# EAGLE design eagleSchem (EAGLE 9.6.2)
CNAME: Microcontroller + Power + Headers; CREVISION: V1.0.0; DESIGNER: Cole Matthews
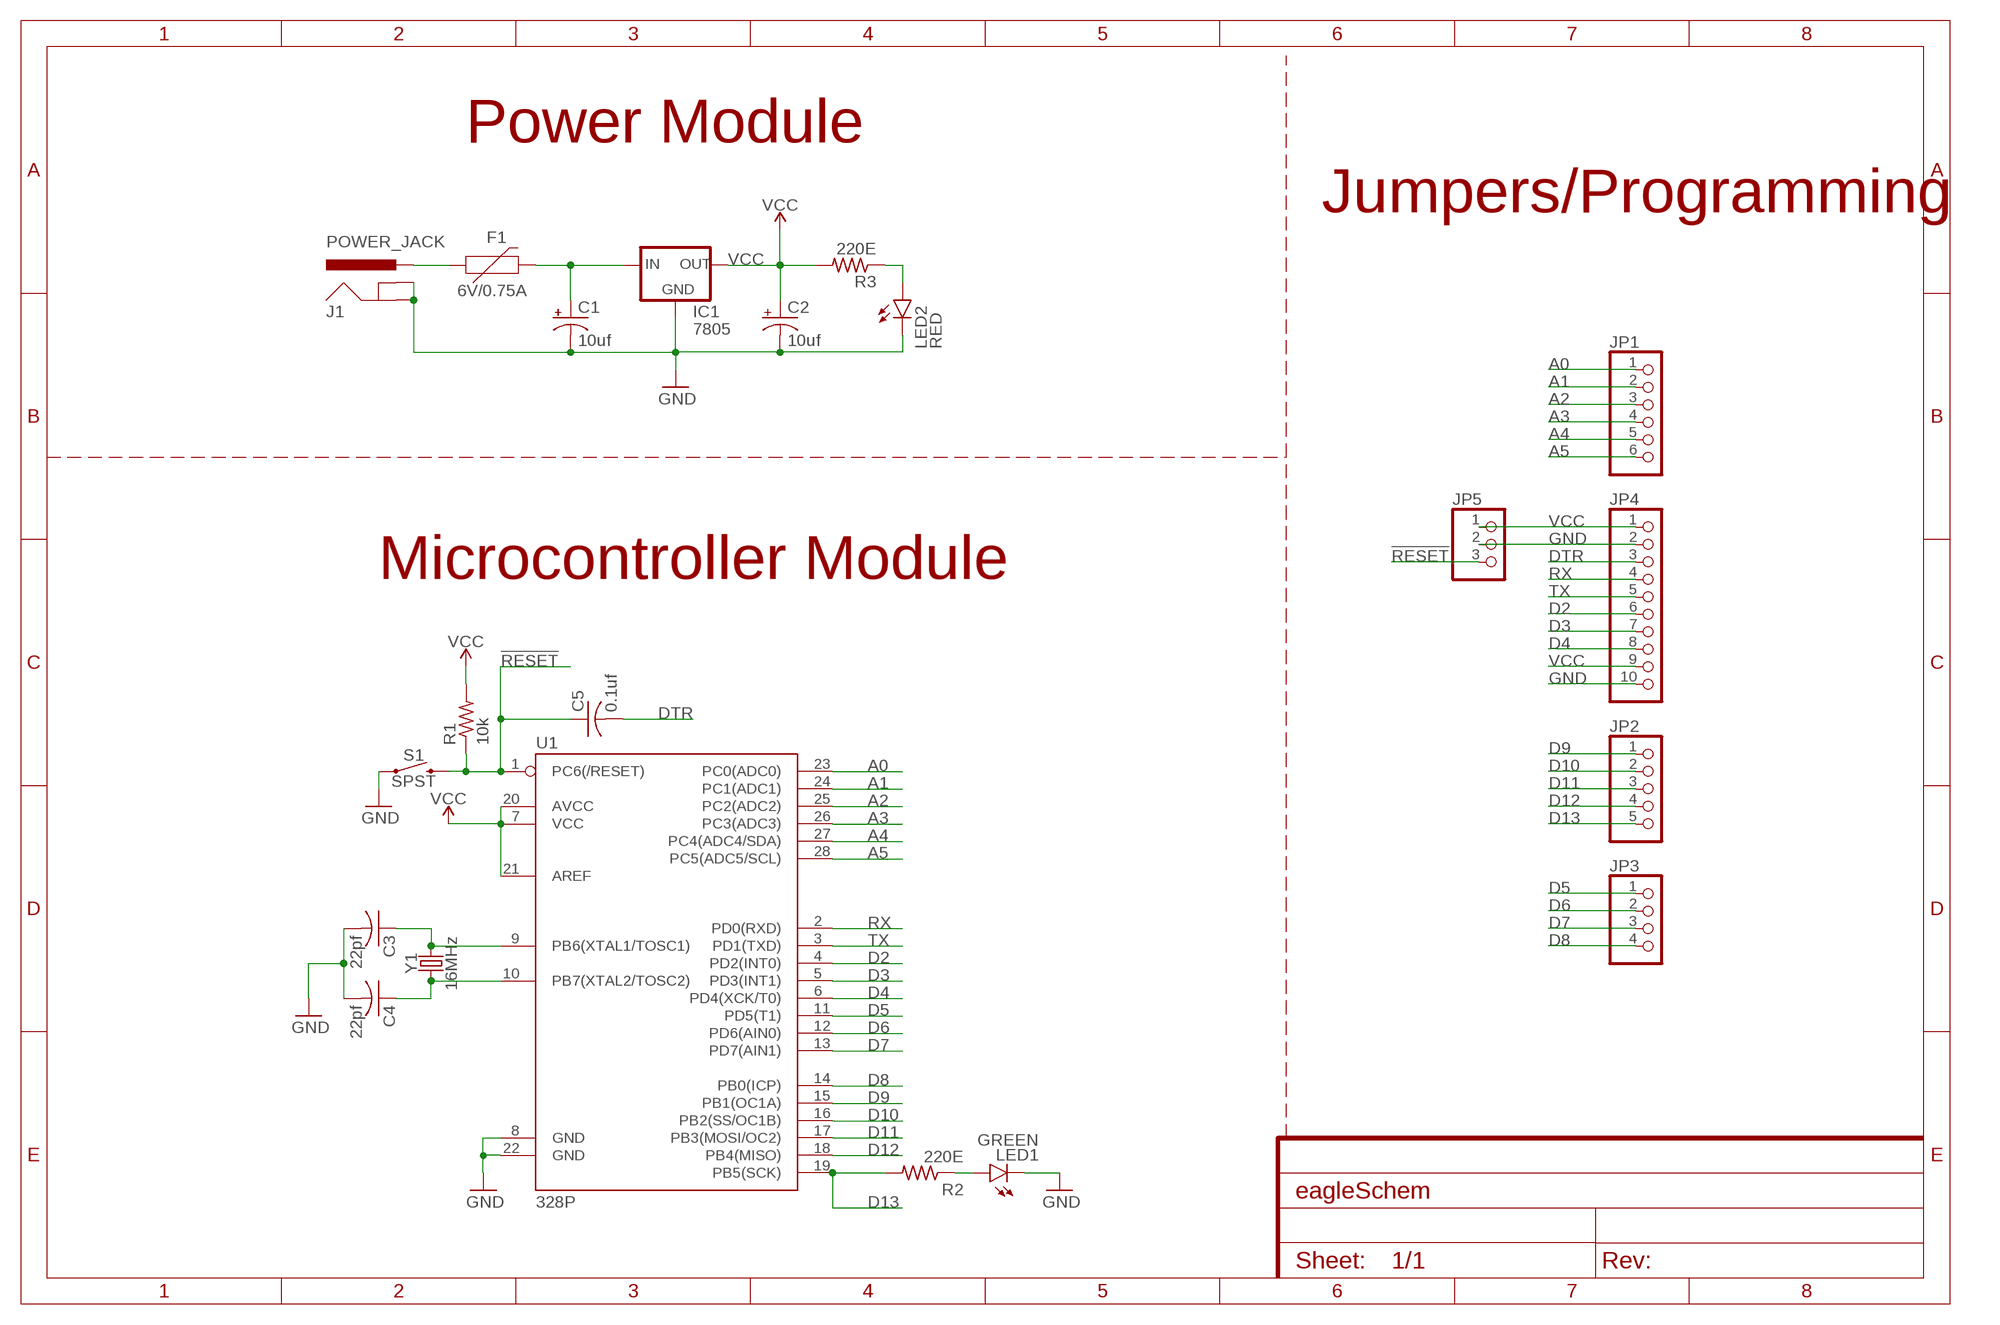
[diagram p0: schematic, sheet 1]

## Parts
C1  10uf  CPOL-USE2.5-6  [E2,5-6]
C2  10uf  CPOL-USE2.5-6  [E2,5-6]
C3  22pf  C-US025-024X044  [C025-024X044]
C4  22pf  C-US025-024X044  [C025-024X044]
C5  0.1uf  C-US025-024X044  [C025-024X044]
F1  6V/0.75A  PPTC_0.75A  [1206]
IC1  7805  78XXS  [78XXS]
J1  POWER_JACK  [POWER_JACK_PTH]
JP1  PINHD-1X6  [1X06]
JP2  PINHD-1X5  [1X05]
JP3  PINHD-1X4  [1X04]
JP4  PINHD-1X10  [1X10]
JP5  PINHD-1X3  [1X03]
LED1  GREEN  LED3MM  [LED3MM]
LED2  RED  LED3MM  [LED3MM]
R1  10k  R-US_0204/7  [0204/7]
R2  220E  R-US_0204/7  [0204/7]
R3  220E  R-US_0204/7  [0204/7]
S1  SPST  MOMENTARY-SWITCH-SPST-PTH-6.0MM  [TACTILE_SWITCH_PTH_6.0MM]
U1  328P  ATMEGA328P_PDIP  [DIP28]
Y1  16MHz  CRYSTAL-16MHZPTH-HC49US  [HC49US]

## Nets
!RESET: C5.1 JP5.3 R1.1 S1.3 U1.1(PC6(/RESET))
A0: JP1.1 U1.23(PC0(ADC0))
A1: JP1.2 U1.24(PC1(ADC1))
A2: JP1.3 U1.25(PC2(ADC2))
A3: JP1.4 U1.26(PC3(ADC3))
A4: JP1.5 U1.27(PC4(ADC4/SDA))
A5: JP1.6 U1.28(PC5(ADC5/SCL))
D2: JP4.6 U1.4(PD2(INT0))
D3: JP4.7 U1.5(PD3(INT1))
D4: JP4.8 U1.6(PD4(XCK/T0))
D5: JP3.1 U1.11(PD5(T1))
D6: JP3.2 U1.12(PD6(AIN0))
D7: JP3.3 U1.13(PD7(AIN1))
D8: JP3.4 U1.14(PB0(ICP))
D9: JP2.1 U1.15(PB1(OC1A))
D10: JP2.2 U1.16(PB2(SS/OC1B))
D11: JP2.3 U1.17(PB3(MOSI/OC2))
D12: JP2.4 U1.18(PB4(MISO))
D13: JP2.5 R2.2 U1.19(PB5(SCK))
DTR: C5.2 JP4.3
GND: C1.- C2.- C3.2 C4.2 IC1.GND J1.GND J1.GNDBREAK JP4.2 JP4.10 JP5.2 LED1.K(C) LED2.K(C) S1.1 U1.8(GND) U1.22(GND)
N$1: C1.+ F1.2 IC1.IN
N$2: C3.1 U1.9(PB6(XTAL1/TOSC1)) Y1.2
N$3: C4.1 U1.10(PB7(XTAL2/TOSC2)) Y1.1
N$5: LED2.A R3.1
N$6: LED1.A R2.1
N$7: F1.1 J1.PWR
RX: JP4.4 U1.2(PD0(RXD))
TX: JP4.5 U1.3(PD1(TXD))
VCC: C2.+ IC1.OUT JP4.1 JP4.9 JP5.1 R1.2 R3.2 U1.7(VCC) U1.20(AVCC) U1.21(AREF)

## Notes on the sheet
- Power Module
- Jumpers/Programming
- Microcontroller Module

## Library data of the parts
C1 C2 = rcl:CPOL-US: POLARIZED CAPACITOR, American symbol; SPICEPREFIX: C
C3-C5 = rcl:C-US: CAPACITOR, American symbol; SPICEPREFIX: C
F1 = SparkFun-Fuses:PPTC: Resettable Fuse PPTC Resettable Fuse. Really a sort of resistor with a polymeric positive temperature coefficient whose resistance increases dramatically with an increase in temperature. When heated by the power passing through the resistance rises causing the current to be limited, protecting the circuit. This is achieved by the transition of the polymer from a crystalline to an amorphous state where the conductive carbon separates breaking the conductive pathways found in the cool crystalline structure. When a PPTC cools back down it resumes conducting letting the circuit turn back on. SparkFun Products: SparkFun RedBoard - Programmed with Arduino <https://www.sparkfun.com/products/12757> Pro Micro - 5V/16MHz <https://www.sparkfun.com/products/12640> Arduino Pro 328 - 5V/16MHz <https://www.sparkfun.com/products/10915> MP3 Trigger <https://www.sparkfun.com/products/13720>; PROD_ID: RES-11150
IC1 = v-reg:78XXS: VOLTAGE REGULATOR
J1 = SparkFun-Connectors:POWER_JACK: Power Jack Connector This is the standard 5.5mm barrel jack for power. The PTH is the most common, proven, reliable, footprint. The Slot footprint only works if the mill layer is transmitted to the PCB fab house so be warned. Here are the connectors we sell at SparkFun: DC Barrel Power Jack/Connector <https://www.sparkfun.com/products/119> (PRT-00119) DC Barrel Power Jack/Connector (SMD) <https://www.sparkfun.com/products/12748> (PRT-12748) DC Barrel Jack Adapter - Breadboard Compatible <https://www.sparkfun.com/products/10811> (PRT-10811) It is used on this SparkFun product (and many, many others): SparkFun RedBoard - Programmed with Arduino <https://www.sparkfun.com/products/12757> (DEV-12757) Also, if you need a mating power supply or connector, please check these out: Wall Adapter Power Supply - 9VDC 650mA <https://www.sparkfun.com/products/298> (TOL-00298) DC Barrel Jack Adapter - Male <https://www.sparkfun.com/products/10287> (PRT-10287); PROD_ID: CONN-08197
JP1 = pinhead:PINHD-1X6: PIN HEADER
JP2 = pinhead:PINHD-1X5: PIN HEADER
JP3 = pinhead:PINHD-1X4: PIN HEADER
JP4 = pinhead:PINHD-1X10: PIN HEADER
JP5 = pinhead:PINHD-1X3: PIN HEADER
LED1 LED2 = led:LED: LED OSRAM: - CHIPLED LG R971, LG N971, LY N971, LG Q971, LY Q971, LO R971, LY R971 LH N974, LH R974 LS Q976, LO Q976, LY Q976 LO Q996 - Hyper CHIPLED LW Q18S LB Q993, LB Q99A, LB R99A - SideLED LS A670, LO A670, LY A670, LG A670, LP A670 LB A673, LV A673, LT A673, LW A673 LH A674 LY A675 LS A676, LA A676, LO A676, LY A676, LW A676 LS A679, LY A679, LG A679 - Hyper Micro SIDELED® LS Y876, LA Y876, LO Y876, LY Y876 LT Y87S - SmartLED LW L88C, LW L88S LB L89C, LB L89S, LG L890 LS L89K, LO L89K, LY L89K LS L896, LA L896, LO L896, LY L896 - TOPLED LS T670, LO T670, LY T670, LG T670, LP T670 LSG T670, LSP T670, LSY T670, LOP T670, LYG T670 LG T671, LOG T671, LSG T671 LB T673, LV T673, LT T673, LW T673 LH T674 LS T676, LA T676, LO T676, LY T676, LB T676, LH T676, LSB T676, LW T676 LB T67C, LV T67C, LT T67C, LS T67K, LO T67K, LY T67K, LW E67C LS E67B, LA E67B, LO E67B, LY E67B, LB E67C, LV E67C, LT E67C LW T67C LS T679, LY T679, LG T679 LS T770, LO T770, LY T770, LG T770, LP T770 LB T773, LV T773, LT T773, LW T773 LH T774 LS E675, LA E675, LY E675, LS T675 LS T776, LA T776, LO T776, LY T776, LB T776 LHGB T686 LT T68C, LB T68C - Hyper Mini TOPLED® LB M676 - Mini TOPLED Santana® LG M470 LS M47K, LO M47K, LY M47K Source: http://www.osram.convergy.de LUXEON: - LUMILED® LXK2-PW12-R00, LXK2-PW12-S00, LXK2-PW14-U00, LXK2-PW14-V00 LXK2-PM12-R00, LXK2-PM12-S00, LXK2-PM14-U00 LXK2-PE12-Q00, LXK2-PE12-R00, LXK2-PE12-S00, LXK2-PE14-T00, LXK2-PE14-U00 LXK2-PB12-K00, LXK2-PB12-L00, LXK2-PB12-M00, LXK2-PB14-N00, LXK2-PB14-P00, LXK2-PB14-Q00 LXK2-PR12-L00, LXK2-PR12-M00, LXK2-PR14-Q00, LXK2-PR14-R00 LXK2-PD12-Q00, LXK2-PD12-R00, LXK2-PD12-S00 LXK2-PH12-R00, LXK2-PH12-S00 LXK2-PL12-P00, LXK2-PL12-Q00, LXK2-PL12-R00 Source: www.luxeon.com KINGBRIGHT: KA-3528ASYC Source: www.kingbright.com
R1-R3 = rcl:R-US_: RESISTOR, American symbol; SPICEPREFIX: R
S1 = SparkFun-Switches:MOMENTARY-SWITCH-SPST: Momentary Switch (Pushbutton) - SPST Normally-open (NO) SPST momentary switches (buttons, pushbuttons). Variants PTH-12MM - 12mm square, through-hole Momentary Pushbutton Switch - 12mm Square <https://www.sparkfun.com/products/9190> (COM-09190) PTH-6.0MM, PTH-6.0MM-KIT - 6.0mm square, through-hole Mini Pushbutton Switch <https://www.sparkfun.com/products/97> (COM-00097) KIT package intended for soldering kit's - only one side of pads' copper is exposed. PTH-RIGHT-ANGLE-KIT - Right-angle, through-hole Right Angle Tactile Button <https://www.sparkfun.com/products/10791> - Used on SparkFun BigTime Watch Kit <https://www.sparkfun.com/products/11734> SMD-12MM - 12mm square, surface-mount Tactile Button - SMD (12mm) <https://www.sparkfun.com/products/12993> (COM-12993) Used on SparkFun PicoBoard <https://www.sparkfun.com/products/11888> SMD-4.5MM - 4.5mm Square Trackball Switch Used on SparkFun Blackberry Trackballer Breakout <https://www.sparkfun.com/products/13169> SMD-4.6MMX2.8MM - 4.60mm x 2.80mm, surface mount Used on SparkFun SAMD21 Mini Breakout <https://www.sparkfun.com/products/13664> SMD-5.2MM, SMD-5.2-REDUNDANT - 5.2mm square, surface-mount Mini Pushbutton Switch - SMD <https://www.sparkfun.com/products/8720> (COM-08720) Used on Arduino Pro Mini <https://www.sparkfun.com/products/11114> REDUNDANT package connects both switch circuits together SMD-6.0X3.5MM - 6.0 x 3.5mm, surface mount Momentary Reset Switch SMD <https://www.sparkfun.com/products/8229> (COM-08229) SMD-6.2MM-TALL - 6.2mm square, surface mount Tactile Button - SMD (6mm) <https://www.sparkfun.com/products/12992> Used on SparkFun Digital Sandbox <https://www.sparkfun.com/products/12651> SMD-RIGHT-ANGLE - Right-angle, surface mount Used on SparkFun Block for Intel® Edison - Arduino <https://www.sparkfun.com/products/13036>; PROD_ID: SWCH-08441; SF_SKU: COM-00097
U1 = SparkFun-IC-Microcontroller:ATMEGA328P_PDIP: Atmel 328P Through hole ATMEGA328P uC used in the Arduino 32kb flash, 1k EEPROM, 2k SRAM Datasheet <http://www.sparkfun.com/datasheets/Components/SMD/ATMega328.pdf> SparkFun Products Storefront component: AVR 28 Pin 20MHz 32K 6A/D - ATMega328P <https://www.sparkfun.com/products/9061> (COM-09061) SparkFun Simon Says - Through-Hole Soldering Kit <https://www.sparkfun.com/products/10547> (KIT-10547) SparkFun Learn to Solder - Simon Says <https://www.sparkfun.com/products/13708> (KIT-13708) SparkFun BigTime Watch Kit <https://www.sparkfun.com/products/11734> (KIT-11734) SparkFun ClockIt <https://www.sparkfun.com/products/10930> (KIT-10930) SparkFun Serial Enabled LCD Kit <https://www.sparkfun.com/products/10097> (LCD-10097) SparkFun Simon Tilts - Through Hole Soldering Kit <https://www.sparkfun.com/products/12634> (KIT-12634) SparkFun Frequency Counter Kit <https://www.sparkfun.com/products/10140> (KIT-10140) FabFM Radio Kit <https://www.sparkfun.com/products/11043> (KIT-11043) SparkFun Binary Blaster Kit <https://www.sparkfun.com/products/12037> (KIT-12037) SparkFun Metro-Gnome <https://www.sparkfun.com/products/9236> (KIT-09236) ATmega328 with Arduino Optiboot (Uno) <https://www.sparkfun.com/products/10524> (DEV-10524); PROD_ID: IC-09136
Y1 = SparkFun-Clocks:CRYSTAL-16MHZ: 16MHz Crystal Digikey Example <http://www.digikey.com/product-search/en?keywords=535-9122-1-ND> Frequency: 16MHz Frequency Stability: ±50ppm Frequency Tolerance: ±20ppm Load Capacitance: 18pF SparkFun Products: Pro Micro -5V/16MHz <https://www.sparkfun.com/products/12640> SparkFun Serial Enabled LCD Kit <https://www.sparkfun.com/products/10097>; PROD_ID: XTAL-08181; SF_ID: COM-00536

## Board
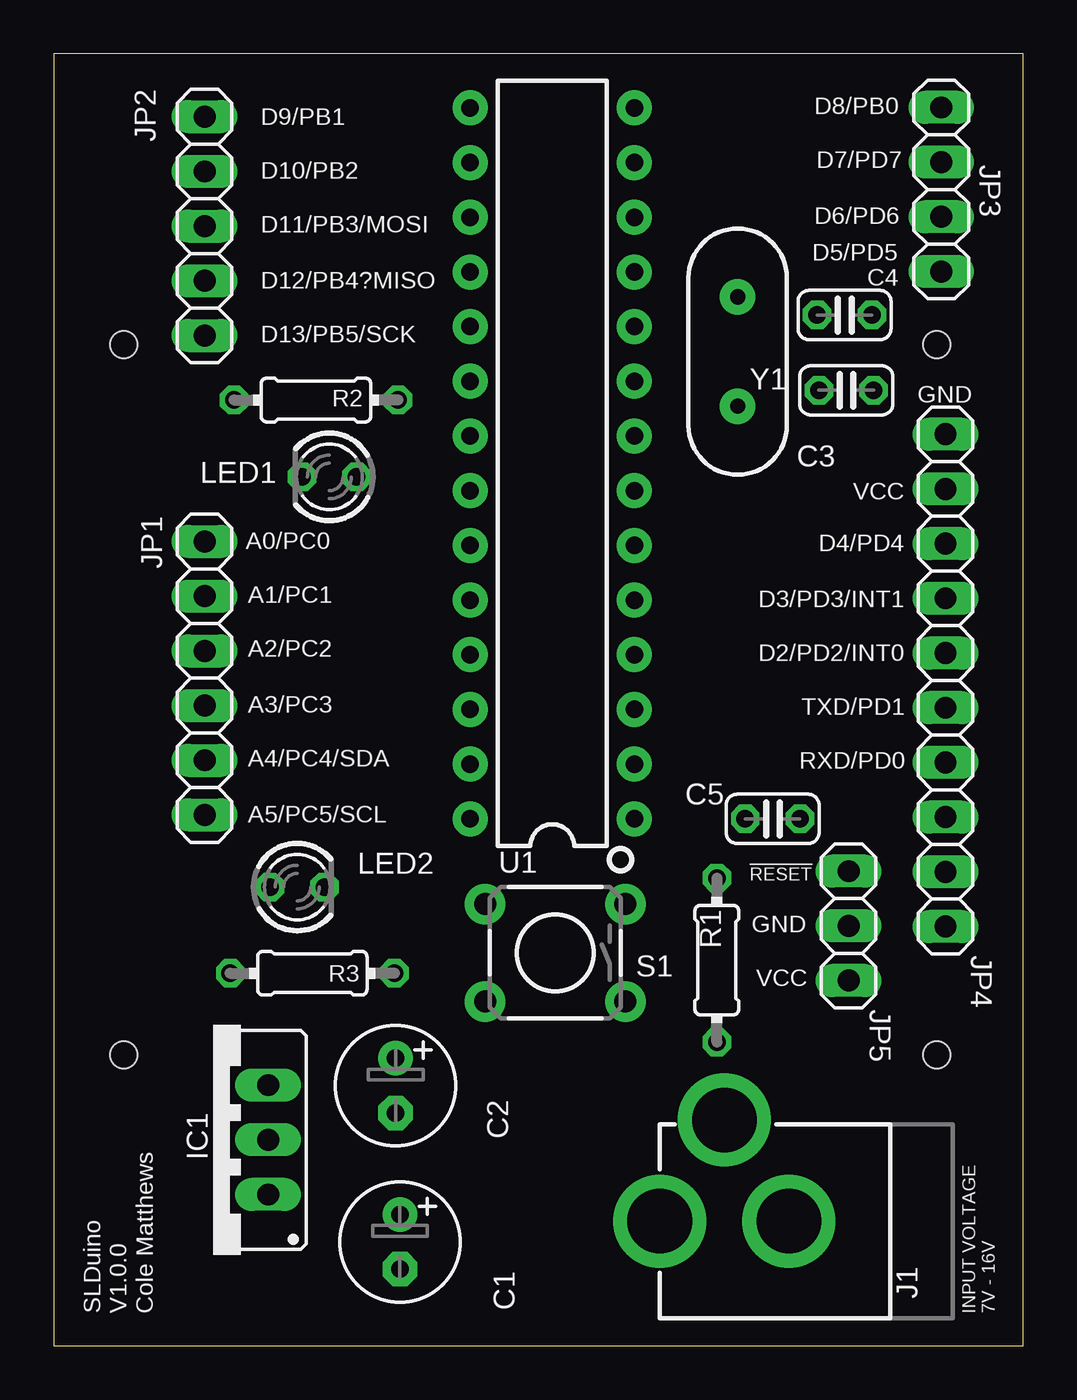
[diagram p1: board, top side]
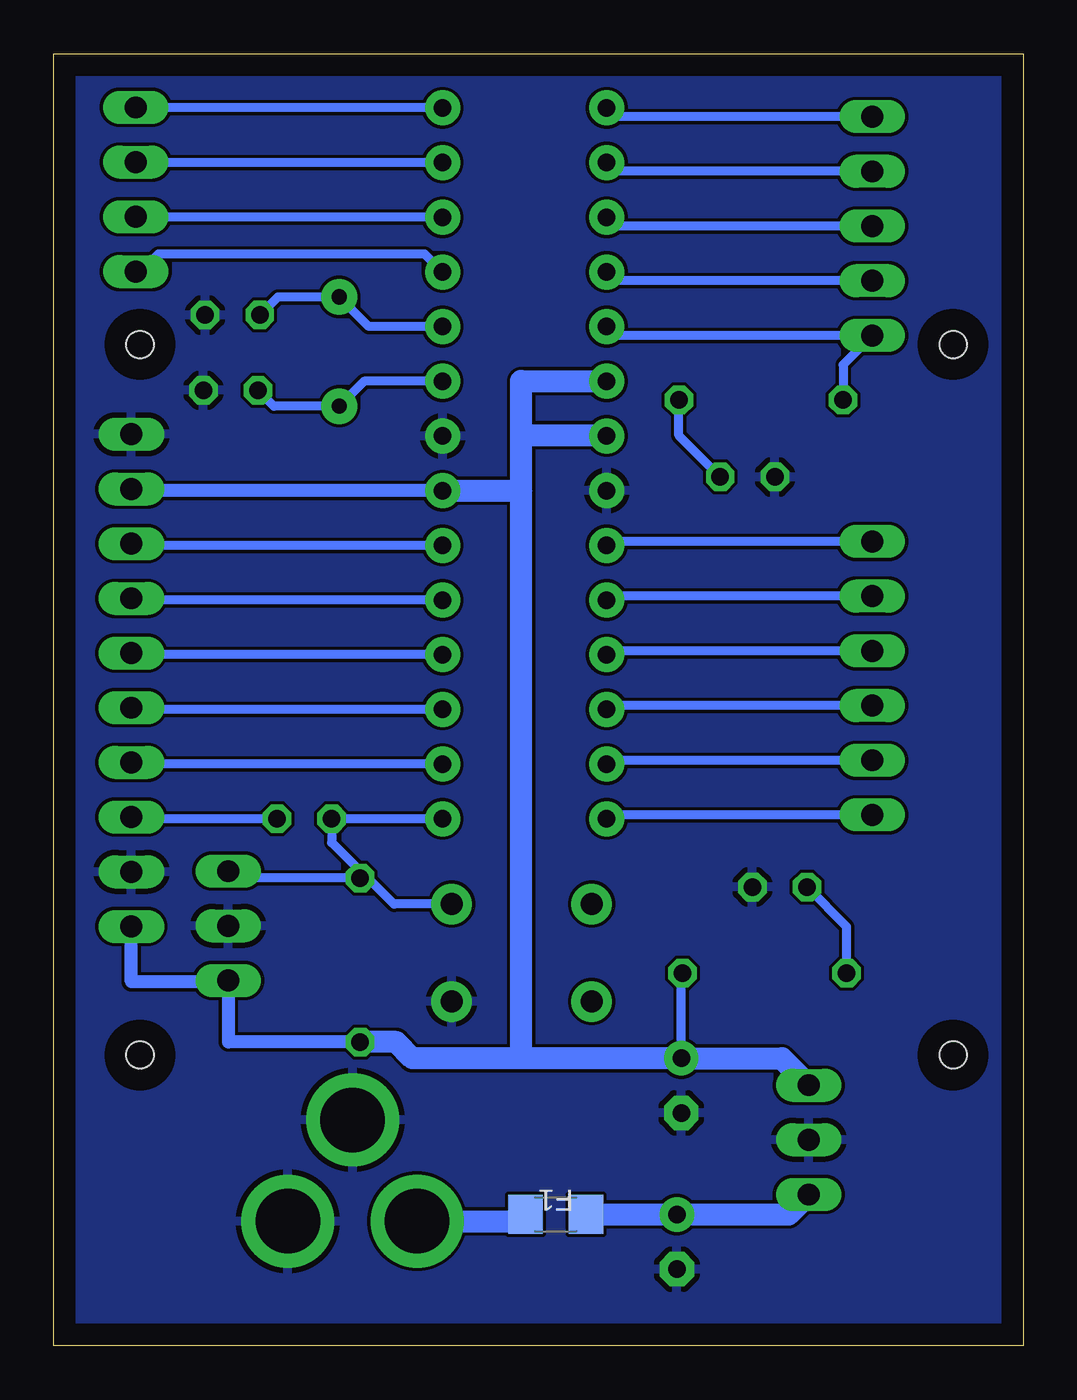
[diagram p2: board, bottom side, seen from below]

Size 45 x 60 mm. Coordinates in mm from the lower left corner, seen from the top.
Outline: 0,0 45,0 45,60 0,60 0,0
Copper layers (1*16): Top 0.035mm / dielectric 1.5mm / Bottom 0.035mm
Design rules "default": minimum track width 6mil, minimum drill 0.35mm, track to track 6mil, track to pad 6mil, pad to pad 6mil, via to via 6mil, smd to smd 6mil, copper to edge 40mil, drill to drill 6mil, minimum pad ring 10mil, minimum via ring 8mil, stop-mask expansion 4mil, vias tented up to drill 0mil, thermal gap 10mil
Holes 1.25 mm at 41,13.5 3.25,46.5 41,46.5 3.25,13.5

### Footprints (pad centres in the part's own frame; a part is rotated, then mirrored left to right if it is on the bottom)
E2,5-6 = drill 0.813 pad 1.6: + -1.27,0 | drill 0.813 pad 1.6 octagon: - 1.27,0
C025-024X044 = drill 0.813 octagon: 1 -1.27,0; 2 1.27,0
1206 = smd 1.6 x 1.8: 1 -1.4,0; 2 1.4,0
78XXS = drill 1.016 long: GND 0,-2.54; IN -2.54,-2.54; OUT 2.54,-2.54
POWER_JACK_PTH = drill 2.997 pad 4.318: GND 0,7.7; GNDBREAK 4.7,10.7; PWR 0,13.7
1X06 = drill 1.016 long: 1 -6.35,0; 2 -3.81,0; 3 -1.27,0; 4 1.27,0; 5 3.81,0; 6 6.35,0
1X05 = drill 1.016 long: 1 -5.08,0; 2 -2.54,0; 3 0,0; 4 2.54,0; 5 5.08,0
1X04 = drill 1.016 long: 1 -3.81,0; 2 -1.27,0; 3 1.27,0; 4 3.81,0
1X10 = drill 1.016 long: 1 -11.43,0; 2 -8.89,0; 3 -6.35,0; 4 -3.81,0; 5 -1.27,0; 6 1.27,0; 7 3.81,0; 8 6.35,0; 9 8.89,0; 10 11.43,0
1X03 = drill 1.016 long: 1 -2.54,0; 2 0,0; 3 2.54,0
LED3MM = drill 0.813 octagon: A -1.27,0; K 1.27,0
0204/7 = drill 0.813 octagon: 1 -3.81,0; 2 3.81,0
TACTILE_SWITCH_PTH_6.0MM = drill 1.016 pad 1.88: 1 -3.251,2.261; 2 3.251,2.261; 3 -3.251,-2.261; 4 3.251,-2.261
DIP28 = drill 0.813 pad 1.626: 1 -16.51,-3.81; 2 -13.97,-3.81; 3 -11.43,-3.81; 4 -8.89,-3.81; 5 -6.35,-3.81; 6 -3.81,-3.81; 7 -1.27,-3.81; 8 1.27,-3.81; 9 3.81,-3.81; 10 6.35,-3.81; 11 8.89,-3.81; 12 11.43,-3.81; 13 13.97,-3.81; 14 16.51,-3.81; 15 16.51,3.81; 16 13.97,3.81; 17 11.43,3.81; 18 8.89,3.81; 19 6.35,3.81; 20 3.81,3.81; 21 1.27,3.81; 22 -1.27,3.81; 23 -3.81,3.81; 24 -6.35,3.81; 25 -8.89,3.81; 26 -11.43,3.81; 27 -13.97,3.81; 28 -16.51,3.81
HC49US = drill 0.7 pad 1.651: 1 -2.54,0; 2 2.54,0

### Placement (x,y rotation side)
C1  16.07,4.82 270 top
C2  15.87,12.08 270 top
C3  36.79,44.37 0 top
C4  36.71,47.87 0 top
C5  33.37,24.47 0 top
F1  21.7,6.1 0 bottom
IC1  7.41,9.56 90 top
J1  41.83,5.78 90 top
JP1  7,31 270 top
JP2  7,52 270 top
JP3  41.2,53.7 90 top
JP4  41.4,30.9 90 top
JP5  36.9,19.5 90 top
LED1  12.79,40.35 180 top
LED2  11.3,21.3 0 top
R1  30.78,17.91 270 top
R2  12.17,43.92 180 top
R3  12,17.3 0 top
S1  23.28,18.25 180 top
U1  23.14,40.98 90 top
Y1  31.75,46.17 270 top

### Tracks (layer width: path | path; a pad name or v marks a point on that pad's centre or on a via)
!RESET
  Bottom 0.406: U1.1 C5.1 32.1,23.37 30.78,22.05 R1.1 | R1.1 36.58,21.72 JP5.3 | S1.3 29.19,20.51 29.2,20.5 30.42,21.72 R1.1
A0
  Bottom 0.406: JP1.1 19.15,37.35 U1.23
A1
  Bottom 0.406: JP1.2 19.15,34.81 U1.24
A2
  Bottom 0.406: JP1.3 19.15,32.27 U1.25
A3
  Bottom 0.406: JP1.4 19.15,29.73 U1.26
A4
  Bottom 0.406: JP1.5 19.15,27.19 U1.27
A5
  Bottom 0.406: JP1.6 19.15,24.65 U1.28
D2
  Bottom 0.406: U1.4 41.32,32.09 JP4.6
D3
  Bottom 0.406: U1.5 41.32,34.63 JP4.7
D4
  Bottom 0.406: U1.6 41.32,37.17 JP4.8
D5
  Bottom 0.406: JP3.1 41.08,49.77 40.15,50.7 27.78,50.7 U1.11
D6
  Bottom 0.406: U1.12 41.18,52.41 JP3.2
D7
  Bottom 0.406: U1.13 41.18,54.95 JP3.3
D8
  Bottom 0.406: U1.14 41.18,57.49 JP3.4
D9
  Bottom 0.406: JP2.1 18.92,57.08 U1.15
D10
  Bottom 0.406: JP2.2 18.92,54.54 U1.16
D11
  Bottom 0.406: JP2.3 18.92,52 U1.17
D12
  Bottom 0.406: JP2.4 18.92,49.46 U1.18
D13
  Bottom 0.406: U1.19 18.92,46.92 JP2.5 8.36,45.56 R2.2
DTR
  Bottom 0.406: C5.2 41.32,24.47 JP4.3
GND
  pour Bottom: 0,0 45,0 45,60 0,60
N$1
  Bottom 1.016: F1.2 C1.+ 10.88,6.09 IC1.IN
N$2
  Bottom 0.406: U1.9 30.59,44.79 Y1.2 34.78,43.63 C3.1
N$3
  Bottom 0.406: U1.10 30.37,47.33 Y1.1 34.6,48.71 C4.1
N$5
  Bottom 0.406: R3.1 8.19,19.46 LED2.A
N$6
  Bottom 0.406: LED1.A 15.98,42.27 R2.1
N$7
  Bottom 1.016: J1.PWR 23.42,5.78 F1.1
RX
  Bottom 0.406: U1.2 41.32,27.01 JP4.4
TX
  Bottom 0.406: U1.3 41.32,29.55 JP4.5
VCC
  Bottom 0.406: C2.+ 15.87,17.24 R3.2 | 41.32,39.71 JP4.9
  Bottom 0.61: R1.2 36.9,14.1 36.9,16.9 | 36.9,16.9 41.4,16.9 JP4.1 | U1.7 41.32,39.71 | JP5.1 36.9,16.9
  Bottom 1.016: IC1.OUT 11.2,13.35 C2.+ 23.3,13.35 | 23.3,13.35 23.3,39.7 | 23.3,39.7 23.3,42.3 | 23.3,42.3 19.38,42.3 U1.21 | U1.7 23.31,39.71 23.3,39.7 | 23.3,13.35 28.35,13.35 29.1,14.1 R1.2 | 23.3,42.3 23.3,44.8 U1.20

### Text on the board
_tsilk: D9/PB1 | D8/PB0 | D7/PD7 | D10/PB2 | D11/PB3/MOSI | D6/PD6 | D5/PD5 | D12/PB4?MISO | D13/PB5/SCK | GND | VCC | A0/PC0 | D4/PD4 | A1/PC1 | D3/PD3/INT1 | A2/PC2 | D2/PD2/INT0 | A3/PC3 | TXD/PD1 | A4/PC4/SDA | RXD/PD0 | A5/PC5/SCL | !RESET | GND | VCC | SLDuino / V1.0.0 / Cole Matthews | INPUT VOLTAGE / 7V - 16V